# Altium project PCB-Tester-Board-V1.PrjPcb (part 3 of 3)

## Sheet PowerRouting.SchDoc
size A4; DateDraw: Date Draw; DateChecked: Date Review; Workspace: Workspace; TitleTyp: Title-Typ; PageSetup: Record=PageOptions|CenterHorizontal=True|CenterVertical=True|PrintScale=0.97|XCorrection=1.00|YCorrection=1.00|PrintKind=0|BorderSize=5000000|LeftOffset=0|BottomOffset=0|Orientation=2|PaperLength=1000|PaperWidth=1000|Scale=100|PaperSource=7|PrintQuality=-3|MediaType=1|DitherType=10|PrintScaleMode=1|PaperKind=A4|PaperIndex=9
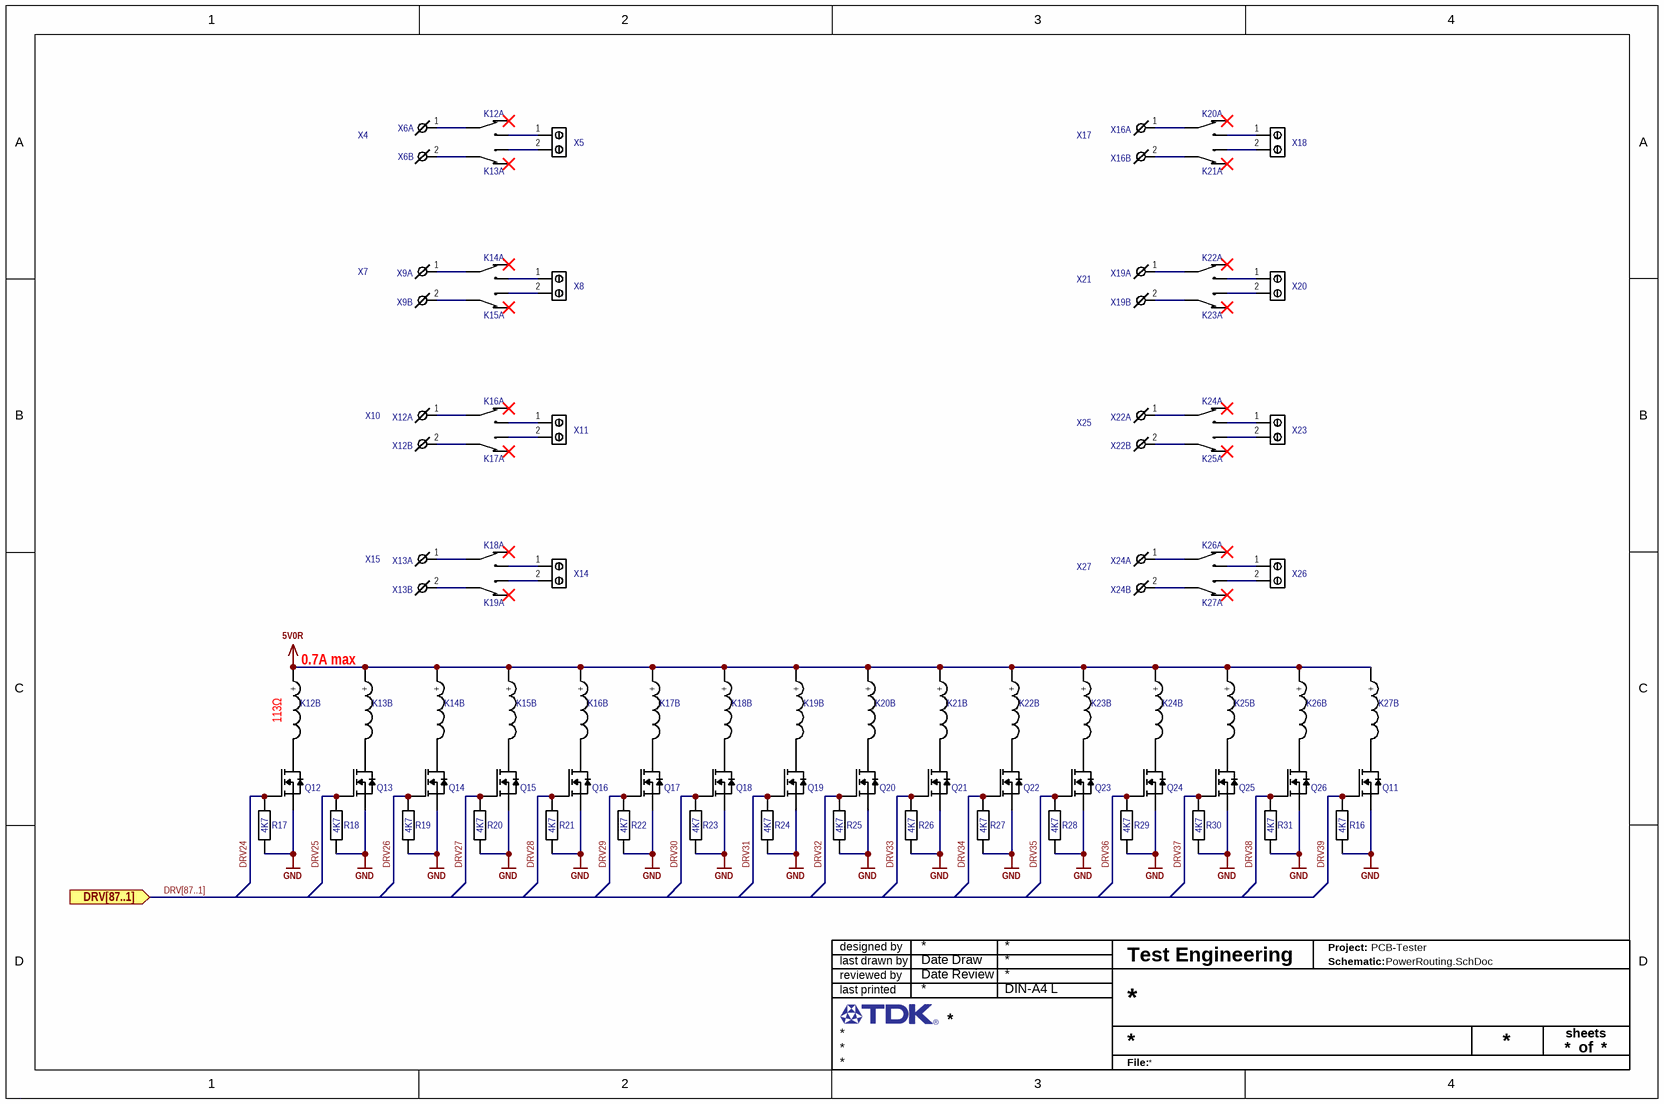
[diagram p11: PowerRouting.SchDoc]

### Parts
K12  K  [HF118F005-1ZS1]  (value not drawn)  (parts A,B of 2)
K13  K  [HF118F005-1ZS1]  (value not drawn)  (parts A,B of 2)
K14  K  [HF118F005-1ZS1]  (value not drawn)  (parts A,B of 2)
K15  K  [HF118F005-1ZS1]  (value not drawn)  (parts A,B of 2)
K16  K  [HF118F005-1ZS1]  (value not drawn)  (parts A,B of 2)
K17  K  [HF118F005-1ZS1]  (value not drawn)  (parts A,B of 2)
K18  K  [HF118F005-1ZS1]  (value not drawn)  (parts A,B of 2)
K19  K  [HF118F005-1ZS1]  (value not drawn)  (parts A,B of 2)
K20  K  [HF118F005-1ZS1]  (value not drawn)  (parts A,B of 2)
K21  K  [HF118F005-1ZS1]  (value not drawn)  (parts A,B of 2)
K22  K  [HF118F005-1ZS1]  (value not drawn)  (parts A,B of 2)
K23  K  [HF118F005-1ZS1]  (value not drawn)  (parts A,B of 2)
K24  K  [HF118F005-1ZS1]  (value not drawn)  (parts A,B of 2)
K25  K  [HF118F005-1ZS1]  (value not drawn)  (parts A,B of 2)
K26  K  [HF118F005-1ZS1]  (value not drawn)  (parts A,B of 2)
K27  K  [HF118F005-1ZS1]  (value not drawn)  (parts A,B of 2)
Q11  Q  [SOT23-3]  (value not drawn)
Q12  Q  [SOT23-3]  (value not drawn)
Q13  Q  [SOT23-3]  (value not drawn)
Q14  Q  [SOT23-3]  (value not drawn)
Q15  Q  [SOT23-3]  (value not drawn)
Q16  Q  [SOT23-3]  (value not drawn)
Q17  Q  [SOT23-3]  (value not drawn)
Q18  Q  [SOT23-3]  (value not drawn)
Q19  Q  [SOT23-3]  (value not drawn)
Q20  Q  [SOT23-3]  (value not drawn)
Q21  Q  [SOT23-3]  (value not drawn)
Q22  Q  [SOT23-3]  (value not drawn)
Q23  Q  [SOT23-3]  (value not drawn)
Q24  Q  [SOT23-3]  (value not drawn)
Q25  Q  [SOT23-3]  (value not drawn)
Q26  Q  [SOT23-3]  (value not drawn)
R16  value 4K7  [R0402 Reflow]  (hidden comment: R)
R17  value 4K7  [R0402 Reflow]  (hidden comment: R)
R18  value 4K7  [R0402 Reflow]  (hidden comment: R)
R19  value 4K7  [R0402 Reflow]  (hidden comment: R)
R20  value 4K7  [R0402 Reflow]  (hidden comment: R)
R21  value 4K7  [R0402 Reflow]  (hidden comment: R)
R22  value 4K7  [R0402 Reflow]  (hidden comment: R)
R23  value 4K7  [R0402 Reflow]  (hidden comment: R)
R24  value 4K7  [R0402 Reflow]  (hidden comment: R)
R25  value 4K7  [R0402 Reflow]  (hidden comment: R)
R26  value 4K7  [R0402 Reflow]  (hidden comment: R)
R27  value 4K7  [R0402 Reflow]  (hidden comment: R)
R28  value 4K7  [R0402 Reflow]  (hidden comment: R)
R29  value 4K7  [R0402 Reflow]  (hidden comment: R)
R30  value 4K7  [R0402 Reflow]  (hidden comment: R)
R31  value 4K7  [R0402 Reflow]  (hidden comment: R)
X4  X  [691352710002]  (value not drawn)
X5  X  [1731721]  (value not drawn)
X6  X  [691312710002]  (value not drawn)  (parts A,B of 2)
X7  X  [691352710002]  (value not drawn)
X8  X  [1731721]  (value not drawn)
X9  X  [691312710002]  (value not drawn)  (parts A,B of 2)
X10  X  [691352710002]  (value not drawn)
X11  X  [1731721]  (value not drawn)
X12  X  [691312710002]  (value not drawn)  (parts A,B of 2)
X13  X  [691312710002]  (value not drawn)  (parts A,B of 2)
X14  X  [1731721]  (value not drawn)
X15  X  [691352710002]  (value not drawn)
X16  X  [691312710002]  (value not drawn)  (parts A,B of 2)
X17  X  [691352710002]  (value not drawn)
X18  X  [1731721]  (value not drawn)
X19  X  [691312710002]  (value not drawn)  (parts A,B of 2)
X20  X  [1731721]  (value not drawn)
X21  X  [691352710002]  (value not drawn)
X22  X  [691312710002]  (value not drawn)  (parts A,B of 2)
X23  X  [1731721]  (value not drawn)
X24  X  [691312710002]  (value not drawn)  (parts A,B of 2)
X25  X  [691352710002]  (value not drawn)
X26  X  [1731721]  (value not drawn)
X27  X  [691352710002]  (value not drawn)

### Ports
DRV[87..1] (in)

### Nets
5V0R: K12.1(+) K13.1(+) K14.1(+) K15.1(+) K16.1(+) K17.1(+) K18.1(+) K19.1(+) K20.1(+) K21.1(+) K22.1(+) K23.1(+) K24.1(+) K25.1(+) K26.1(+) K27.1(+)
GND: Q11.2(S) Q12.2(S) Q13.2(S) Q14.2(S) Q15.2(S) Q16.2(S) Q17.2(S) Q18.2(S) Q19.2(S) Q20.2(S) Q21.2(S) Q22.2(S) Q23.2(S) Q24.2(S) Q25.2(S) Q26.2(S) R16.1 R17.1 R18.1 R19.1 R20.1 R21.1 R22.1 R23.1 R24.1 R25.1 R26.1 R27.1 R28.1 R29.1 R30.1 R31.1
DRV24: Q12.1(G) R17.2
DRV25: Q13.1(G) R18.2
DRV26: Q14.1(G) R19.2
DRV27: Q15.1(G) R20.2
DRV28: Q16.1(G) R21.2
DRV29: Q17.1(G) R22.2
DRV30: Q18.1(G) R23.2
DRV31: Q19.1(G) R24.2
DRV32: Q20.1(G) R25.2
DRV33: Q21.1(G) R26.2
DRV34: Q22.1(G) R27.2
DRV35: Q23.1(G) R28.2
DRV36: Q24.1(G) R29.2
DRV37: Q25.1(G) R30.2
DRV38: Q26.1(G) R31.2
DRV39: Q11.1(G) R16.2
NetK12_2: K12.2(Cin) X6.1(+)
NetK12_3: K12.3(Cno) X5.1
NetK12_5: K12.5(-) Q12.3(D)
NetK13_2: K13.2(Cin) X6.2(-)
NetK13_3: K13.3(Cno) X5.2
NetK13_5: K13.5(-) Q13.3(D)
NetK14_2: K14.2(Cin) X9.1(+)
NetK14_3: K14.3(Cno) X8.1
NetK14_5: K14.5(-) Q14.3(D)
NetK15_2: K15.2(Cin) X9.2(-)
NetK15_3: K15.3(Cno) X8.2
NetK15_5: K15.5(-) Q15.3(D)
NetK16_2: K16.2(Cin) X12.1(+)
NetK16_3: K16.3(Cno) X11.1
NetK16_5: K16.5(-) Q16.3(D)
NetK17_2: K17.2(Cin) X12.2(-)
NetK17_3: K17.3(Cno) X11.2
NetK17_5: K17.5(-) Q17.3(D)
NetK18_2: K18.2(Cin) X13.1(+)
NetK18_3: K18.3(Cno) X14.1
NetK18_5: K18.5(-) Q18.3(D)
NetK19_2: K19.2(Cin) X13.2(-)
NetK19_3: K19.3(Cno) X14.2
NetK19_5: K19.5(-) Q19.3(D)
NetK20_2: K20.2(Cin) X16.1(+)
NetK20_3: K20.3(Cno) X18.1
NetK20_5: K20.5(-) Q20.3(D)
NetK21_2: K21.2(Cin) X16.2(-)
NetK21_3: K21.3(Cno) X18.2
NetK21_5: K21.5(-) Q21.3(D)
NetK22_2: K22.2(Cin) X19.1(+)
NetK22_3: K22.3(Cno) X20.1
NetK22_5: K22.5(-) Q22.3(D)
NetK23_2: K23.2(Cin) X19.2(-)
NetK23_3: K23.3(Cno) X20.2
NetK23_5: K23.5(-) Q23.3(D)
NetK24_2: K24.2(Cin) X22.1(+)
NetK24_3: K24.3(Cno) X23.1
NetK24_5: K24.5(-) Q24.3(D)
NetK25_2: K25.2(Cin) X22.2(-)
NetK25_3: K25.3(Cno) X23.2
NetK25_5: K25.5(-) Q25.3(D)
NetK26_2: K26.2(Cin) X24.1(+)
NetK26_3: K26.3(Cno) X26.1
NetK26_5: K26.5(-) Q26.3(D)
NetK27_2: K27.2(Cin) X24.2(-)
NetK27_3: K27.3(Cno) X26.2
NetK27_5: K27.5(-) Q11.3(D)

Not connected (* = marked no-connect by the designer): K12 4(Cnc)*; K13 4(Cnc)*; K14 4(Cnc)*; K15 4(Cnc)*; K16 4(Cnc)*; K17 4(Cnc)*; K18 4(Cnc)*; K19 4(Cnc)*; K20 4(Cnc)*; K21 4(Cnc)*; K22 4(Cnc)*; K23 4(Cnc)*; K24 4(Cnc)*; K25 4(Cnc)*; K26 4(Cnc)*; K27 4(Cnc)*

### Buses and harness runs
bus DRV[87..1] = port DRV[87..1]

### Notes on the sheet
- 0.7A max
- designed by
- reviewed by
- last drawn by
- Project:
- Schematic:
- last printed
- DIN-A4 L
- sheets
- of
- File:

### Library data of the parts
K12-K27 = HF118F005-1ZS1: 5V Power Relay, switch over; 04. Manufacturer: Hongfa Europe GMBH; 07. Manufacturer  Part Number: HF118F/005-1ZS1T(136); 03. Unit Price: 2.60; 13. Created Date/Name: AUG2018/Hören; Coil Resistance: 113Ω; Max Carry Current: 10A; Max Switch Voltage: 440Vac/125Vdc; Power Rating: 300Wdc/2.5KVAac; 01. Distributor: RS-Components; 02. Distributor Part Number: 176-2821; 09. Operating Temperature: -xx..+yy°C; 11. RoHS: YES; ComponentLink1Description: Info; ComponentLink1URL: https://de.rs-online.com/web/p/monostabile-relais/1762821/; ComponentLink2Description: DataSheet; ComponentLink2URL: https://docs.rs-online.com/c37d/0900766b81663e9a.pdf; Coil Voltage: 5V; Max Switch Current: 10A
Q11-Q26 = FDV303N: MOSFET N-CH 25V 680MA SOT-23; 04. Manufacturer: ON Semiconductor; 03. Unit Price: 0.41; 13. Created Date/Name: AUG 2018 / Hören; Rds On: 450 mΩ @ id=500mA & Vgs=4.5V; Vgs,th: 1.5V @ 250uA; Power Rating: 350mW; 3D-Export: No; 01. Distributor: DigiKey; 02. Distributor Part Number: FDV303NDKR-ND; 07. Manufacturer  Part Number: FDV303N; 09. Operating Temperature: -55°C ~ 150°C (TJ); 11. RoHS: YES; ComponentLink1Description: Info; ComponentLink1URL: https://www.digikey.de/product-detail/en/on-semiconductor/FDV303N/FDV303NDKR-ND/1630434; ComponentLink2Description: DataSheet; ComponentLink2URL: https://media.digikey.com/pdf/Data%20Sheets/Fairchild%20PDFs/FDV303N.pdf; Vdss: 25V; Id: 680mA
R16-R31 = R: Resistor; Tolerance: ±1%; 13. Created Date/Name: AUG2018/Hören; ComponentLink1URL: *; ComponentLink1Description: Info; 09. Operating Temperature: -xx..+yy°C; 11. RoHS: ???; ComponentLink2Description: DataSheet; Package: *
X4 X7 X10 X15 X17 X21 X25 X27 = 691352710002: TERM BLOCK PLUG 2POS STR 5MM; 13. Created Date/Name: ??? / Hören; System: Connector; ComponentLink1Description: Info; ComponentLink1URL: https://www.digikey.de/products/en?keywords=691352710002; ComponentLink2Description: DataSheet; ComponentLink2URL: https://www.we-online.de/katalog/datasheet/6913527100xx.pdf
X5 X8 X11 X14 X18 X20 X23 X26 = 1731721: TERM BLK 2P SIDE ENT 7.62MM PCB; 04. Manufacturer: Phoenix Contact; 03. Unit Price: 2.12; 13. Created Date/Name: JAN 2019 / Hören; System: Connector; 01. Distributor: DigiKey; 02. Distributor Part Number: 277-5849-ND; 07. Manufacturer  Part Number: 1731721; 11. RoHS: YES; ComponentLink1Description: Info; ComponentLink1URL: https://www.digikey.de/products/en?keywords=1731721; ComponentLink2Description: DataSheet; ComponentLink2URL: https://media.digikey.com/pdf/Data%20Sheets/Phoenix%20Contact%20PDFs/1731721.pdf
X6 X9 X12 X13 X16 X19 X22 X24 = 691312710002: TERM BLOCK HDR 2POS 90DEG 5MM; 04. Manufacturer: Würth Elektronik; 03. Unit Price: 0.244; 13. Created Date/Name: ??? / Hören; System: Connector; 01. Distributor: DigiKey; 02. Distributor Part Number: 732-2805-ND; 07. Manufacturer  Part Number: 691312710002; ComponentLink1Description: Info; ComponentLink2Description: DataSheet

## Sheet SignalRouting.SchDoc
size A3 portrait; DateDraw: Date Draw; DateChecked: Date Review; Workspace: Workspace; TitleTyp: Title-Typ; PageSetup: Record=PageOptions|CenterHorizontal=True|CenterVertical=True|PrintScale=0.97|XCorrection=1.00|YCorrection=1.00|PrintKind=0|BorderSize=5000000|LeftOffset=0|BottomOffset=0|Orientation=2|PaperLength=1000|PaperWidth=1000|Scale=100|PaperSource=7|PrintQuality=-3|MediaType=1|DitherType=10|PrintScaleMode=1|PaperKind=A4|PaperIndex=9
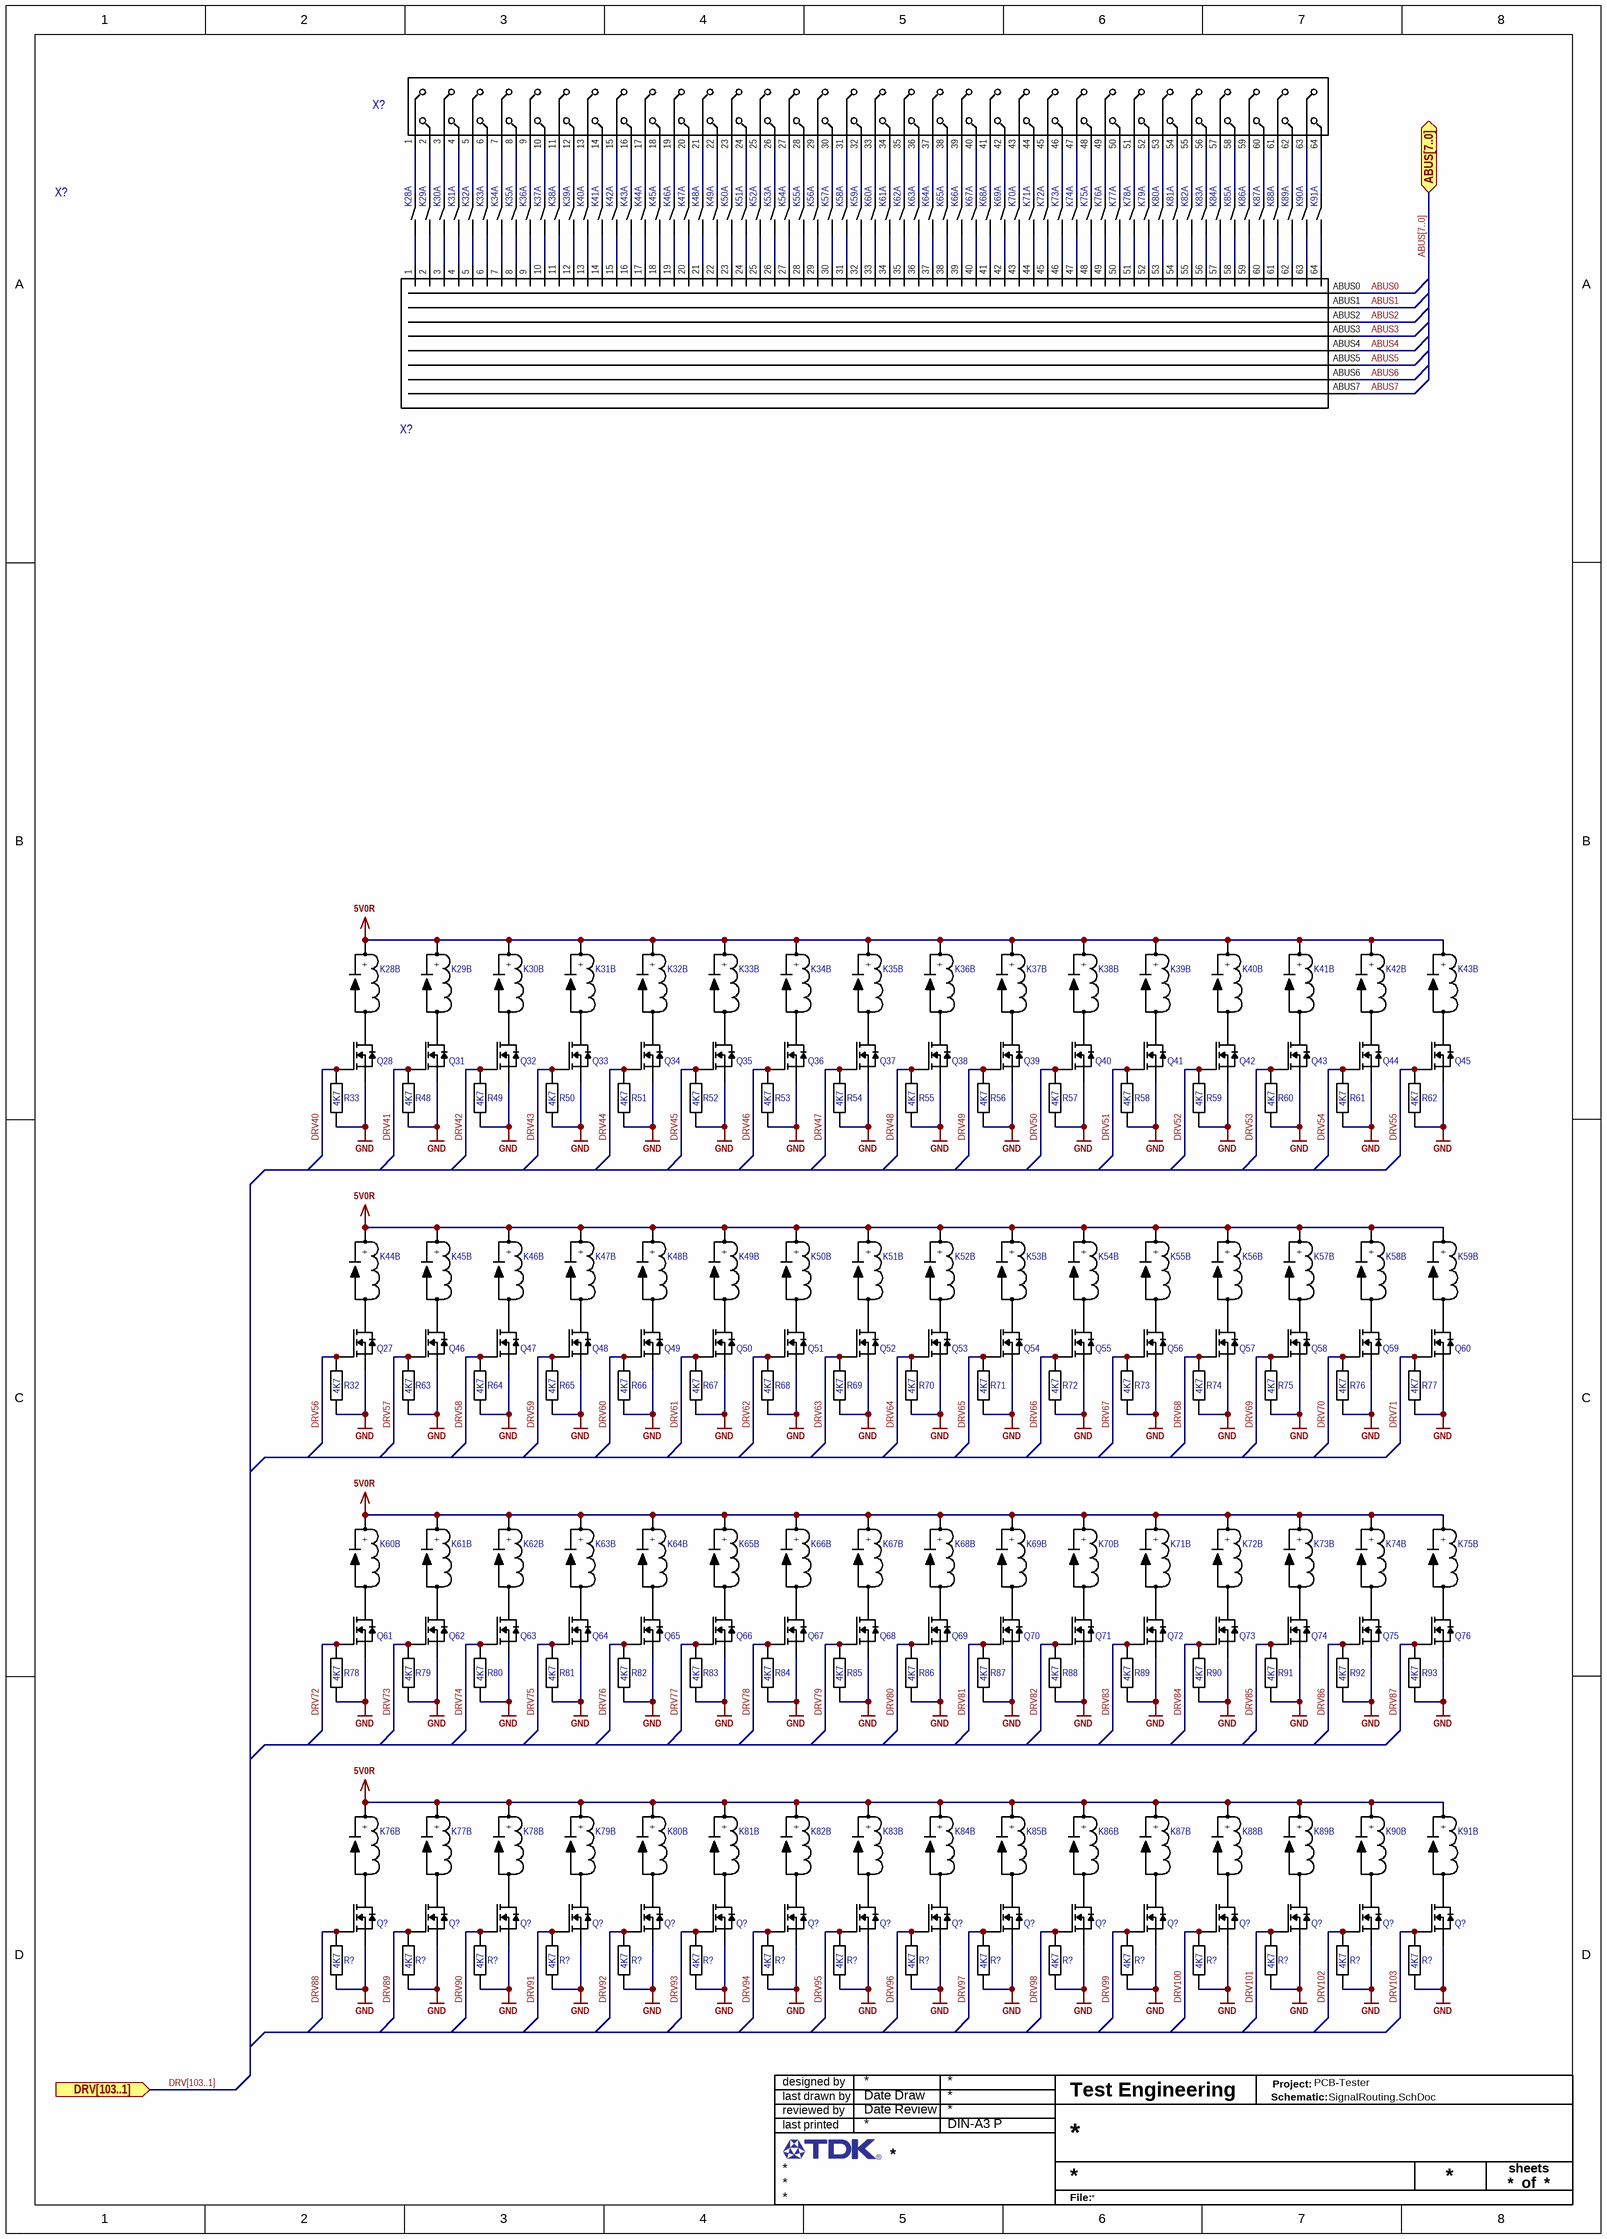
[diagram p12: SignalRouting.SchDoc]

### Parts
(Parts that share a designator on the sheet are numbered #1, #2 ... from top to bottom, then left to right.)
K28  K  [118-1A]  (value not drawn)  (parts A,B of 2)
K29  K  [118-1A]  (value not drawn)  (parts A,B of 2)
K30  K  [118-1A]  (value not drawn)  (parts A,B of 2)
K31  K  [118-1A]  (value not drawn)  (parts A,B of 2)
K32  K  [118-1A]  (value not drawn)  (parts A,B of 2)
K33  K  [118-1A]  (value not drawn)  (parts A,B of 2)
K34  K  [118-1A]  (value not drawn)  (parts A,B of 2)
K35  K  [118-1A]  (value not drawn)  (parts A,B of 2)
K36  K  [118-1A]  (value not drawn)  (parts A,B of 2)
K37  K  [118-1A]  (value not drawn)  (parts A,B of 2)
K38  K  [118-1A]  (value not drawn)  (parts A,B of 2)
K39  K  [118-1A]  (value not drawn)  (parts A,B of 2)
K40  K  [118-1A]  (value not drawn)  (parts A,B of 2)
K41  K  [118-1A]  (value not drawn)  (parts A,B of 2)
K42  K  [118-1A]  (value not drawn)  (parts A,B of 2)
K43  K  [118-1A]  (value not drawn)  (parts A,B of 2)
K44  K  [118-1A]  (value not drawn)  (parts A,B of 2)
K45  K  [118-1A]  (value not drawn)  (parts A,B of 2)
K46  K  [118-1A]  (value not drawn)  (parts A,B of 2)
K47  K  [118-1A]  (value not drawn)  (parts A,B of 2)
K48  K  [118-1A]  (value not drawn)  (parts A,B of 2)
K49  K  [118-1A]  (value not drawn)  (parts A,B of 2)
K50  K  [118-1A]  (value not drawn)  (parts A,B of 2)
K51  K  [118-1A]  (value not drawn)  (parts A,B of 2)
K52  K  [118-1A]  (value not drawn)  (parts A,B of 2)
K53  K  [118-1A]  (value not drawn)  (parts A,B of 2)
K54  K  [118-1A]  (value not drawn)  (parts A,B of 2)
K55  K  [118-1A]  (value not drawn)  (parts A,B of 2)
K56  K  [118-1A]  (value not drawn)  (parts A,B of 2)
K57  K  [118-1A]  (value not drawn)  (parts A,B of 2)
K58  K  [118-1A]  (value not drawn)  (parts A,B of 2)
K59  K  [118-1A]  (value not drawn)  (parts A,B of 2)
K60  K  [118-1A]  (value not drawn)  (parts A,B of 2)
K61  K  [118-1A]  (value not drawn)  (parts A,B of 2)
K62  K  [118-1A]  (value not drawn)  (parts A,B of 2)
K63  K  [118-1A]  (value not drawn)  (parts A,B of 2)
K64  K  [118-1A]  (value not drawn)  (parts A,B of 2)
K65  K  [118-1A]  (value not drawn)  (parts A,B of 2)
K66  K  [118-1A]  (value not drawn)  (parts A,B of 2)
K67  K  [118-1A]  (value not drawn)  (parts A,B of 2)
K68  K  [118-1A]  (value not drawn)  (parts A,B of 2)
K69  K  [118-1A]  (value not drawn)  (parts A,B of 2)
K70  K  [118-1A]  (value not drawn)  (parts A,B of 2)
K71  K  [118-1A]  (value not drawn)  (parts A,B of 2)
K72  K  [118-1A]  (value not drawn)  (parts A,B of 2)
K73  K  [118-1A]  (value not drawn)  (parts A,B of 2)
K74  K  [118-1A]  (value not drawn)  (parts A,B of 2)
K75  K  [118-1A]  (value not drawn)  (parts A,B of 2)
K76  K  [118-1A]  (value not drawn)  (parts A,B of 2)
K77  K  [118-1A]  (value not drawn)  (parts A,B of 2)
K78  K  [118-1A]  (value not drawn)  (parts A,B of 2)
K79  K  [118-1A]  (value not drawn)  (parts A,B of 2)
K80  K  [118-1A]  (value not drawn)  (parts A,B of 2)
K81  K  [118-1A]  (value not drawn)  (parts A,B of 2)
K82  K  [118-1A]  (value not drawn)  (parts A,B of 2)
K83  K  [118-1A]  (value not drawn)  (parts A,B of 2)
K84  K  [118-1A]  (value not drawn)  (parts A,B of 2)
K85  K  [118-1A]  (value not drawn)  (parts A,B of 2)
K86  K  [118-1A]  (value not drawn)  (parts A,B of 2)
K87  K  [118-1A]  (value not drawn)  (parts A,B of 2)
K88  K  [118-1A]  (value not drawn)  (parts A,B of 2)
K89  K  [118-1A]  (value not drawn)  (parts A,B of 2)
K90  K  [118-1A]  (value not drawn)  (parts A,B of 2)
K91  K  [118-1A]  (value not drawn)  (parts A,B of 2)
Q27  Q  [SOT23-3]  (value not drawn)
Q28  Q  [SOT23-3]  (value not drawn)
Q31  Q  [SOT23-3]  (value not drawn)
Q32  Q  [SOT23-3]  (value not drawn)
Q33  Q  [SOT23-3]  (value not drawn)
Q34  Q  [SOT23-3]  (value not drawn)
Q35  Q  [SOT23-3]  (value not drawn)
Q36  Q  [SOT23-3]  (value not drawn)
Q37  Q  [SOT23-3]  (value not drawn)
Q38  Q  [SOT23-3]  (value not drawn)
Q39  Q  [SOT23-3]  (value not drawn)
Q40  Q  [SOT23-3]  (value not drawn)
Q41  Q  [SOT23-3]  (value not drawn)
Q42  Q  [SOT23-3]  (value not drawn)
Q43  Q  [SOT23-3]  (value not drawn)
Q44  Q  [SOT23-3]  (value not drawn)
Q45  Q  [SOT23-3]  (value not drawn)
Q46  Q  [SOT23-3]  (value not drawn)
Q47  Q  [SOT23-3]  (value not drawn)
Q48  Q  [SOT23-3]  (value not drawn)
Q49  Q  [SOT23-3]  (value not drawn)
Q50  Q  [SOT23-3]  (value not drawn)
Q51  Q  [SOT23-3]  (value not drawn)
Q52  Q  [SOT23-3]  (value not drawn)
Q53  Q  [SOT23-3]  (value not drawn)
Q54  Q  [SOT23-3]  (value not drawn)
Q55  Q  [SOT23-3]  (value not drawn)
Q56  Q  [SOT23-3]  (value not drawn)
Q57  Q  [SOT23-3]  (value not drawn)
Q58  Q  [SOT23-3]  (value not drawn)
Q59  Q  [SOT23-3]  (value not drawn)
Q60  Q  [SOT23-3]  (value not drawn)
Q61  Q  [SOT23-3]  (value not drawn)
Q62  Q  [SOT23-3]  (value not drawn)
Q63  Q  [SOT23-3]  (value not drawn)
Q64  Q  [SOT23-3]  (value not drawn)
Q65  Q  [SOT23-3]  (value not drawn)
Q66  Q  [SOT23-3]  (value not drawn)
Q67  Q  [SOT23-3]  (value not drawn)
Q68  Q  [SOT23-3]  (value not drawn)
Q69  Q  [SOT23-3]  (value not drawn)
Q70  Q  [SOT23-3]  (value not drawn)
Q71  Q  [SOT23-3]  (value not drawn)
Q72  Q  [SOT23-3]  (value not drawn)
Q73  Q  [SOT23-3]  (value not drawn)
Q74  Q  [SOT23-3]  (value not drawn)
Q75  Q  [SOT23-3]  (value not drawn)
Q76  Q  [SOT23-3]  (value not drawn)
Q?#1  Q  [SOT23-3]  (value not drawn)
Q?#2  Q  [SOT23-3]  (value not drawn)
Q?#3  Q  [SOT23-3]  (value not drawn)
Q?#4  Q  [SOT23-3]  (value not drawn)
Q?#5  Q  [SOT23-3]  (value not drawn)
Q?#6  Q  [SOT23-3]  (value not drawn)
Q?#7  Q  [SOT23-3]  (value not drawn)
Q?#8  Q  [SOT23-3]  (value not drawn)
Q?#9  Q  [SOT23-3]  (value not drawn)
Q?#10  Q  [SOT23-3]  (value not drawn)
Q?#11  Q  [SOT23-3]  (value not drawn)
Q?#12  Q  [SOT23-3]  (value not drawn)
Q?#13  Q  [SOT23-3]  (value not drawn)
Q?#14  Q  [SOT23-3]  (value not drawn)
Q?#15  Q  [SOT23-3]  (value not drawn)
Q?#16  Q  [SOT23-3]  (value not drawn)
R32  value 4K7  [R0402 Reflow]  (hidden comment: R)
R33  value 4K7  [R0402 Reflow]  (hidden comment: R)
R48  value 4K7  [R0402 Reflow]  (hidden comment: R)
R49  value 4K7  [R0402 Reflow]  (hidden comment: R)
R50  value 4K7  [R0402 Reflow]  (hidden comment: R)
R51  value 4K7  [R0402 Reflow]  (hidden comment: R)
R52  value 4K7  [R0402 Reflow]  (hidden comment: R)
R53  value 4K7  [R0402 Reflow]  (hidden comment: R)
R54  value 4K7  [R0402 Reflow]  (hidden comment: R)
R55  value 4K7  [R0402 Reflow]  (hidden comment: R)
R56  value 4K7  [R0402 Reflow]  (hidden comment: R)
R57  value 4K7  [R0402 Reflow]  (hidden comment: R)
R58  value 4K7  [R0402 Reflow]  (hidden comment: R)
R59  value 4K7  [R0402 Reflow]  (hidden comment: R)
R60  value 4K7  [R0402 Reflow]  (hidden comment: R)
R61  value 4K7  [R0402 Reflow]  (hidden comment: R)
R62  value 4K7  [R0402 Reflow]  (hidden comment: R)
R63  value 4K7  [R0402 Reflow]  (hidden comment: R)
R64  value 4K7  [R0402 Reflow]  (hidden comment: R)
R65  value 4K7  [R0402 Reflow]  (hidden comment: R)
R66  value 4K7  [R0402 Reflow]  (hidden comment: R)
R67  value 4K7  [R0402 Reflow]  (hidden comment: R)
R68  value 4K7  [R0402 Reflow]  (hidden comment: R)
R69  value 4K7  [R0402 Reflow]  (hidden comment: R)
R70  value 4K7  [R0402 Reflow]  (hidden comment: R)
R71  value 4K7  [R0402 Reflow]  (hidden comment: R)
R72  value 4K7  [R0402 Reflow]  (hidden comment: R)
R73  value 4K7  [R0402 Reflow]  (hidden comment: R)
R74  value 4K7  [R0402 Reflow]  (hidden comment: R)
R75  value 4K7  [R0402 Reflow]  (hidden comment: R)
R76  value 4K7  [R0402 Reflow]  (hidden comment: R)
R77  value 4K7  [R0402 Reflow]  (hidden comment: R)
R78  value 4K7  [R0402 Reflow]  (hidden comment: R)
R79  value 4K7  [R0402 Reflow]  (hidden comment: R)
R80  value 4K7  [R0402 Reflow]  (hidden comment: R)
R81  value 4K7  [R0402 Reflow]  (hidden comment: R)
R82  value 4K7  [R0402 Reflow]  (hidden comment: R)
R83  value 4K7  [R0402 Reflow]  (hidden comment: R)
R84  value 4K7  [R0402 Reflow]  (hidden comment: R)
R85  value 4K7  [R0402 Reflow]  (hidden comment: R)
R86  value 4K7  [R0402 Reflow]  (hidden comment: R)
R87  value 4K7  [R0402 Reflow]  (hidden comment: R)
R88  value 4K7  [R0402 Reflow]  (hidden comment: R)
R89  value 4K7  [R0402 Reflow]  (hidden comment: R)
R90  value 4K7  [R0402 Reflow]  (hidden comment: R)
R91  value 4K7  [R0402 Reflow]  (hidden comment: R)
R92  value 4K7  [R0402 Reflow]  (hidden comment: R)
R93  value 4K7  [R0402 Reflow]  (hidden comment: R)
R?#1  value 4K7  [R0402 Reflow]  (hidden comment: R)
R?#2  value 4K7  [R0402 Reflow]  (hidden comment: R)
R?#3  value 4K7  [R0402 Reflow]  (hidden comment: R)
R?#4  value 4K7  [R0402 Reflow]  (hidden comment: R)
R?#5  value 4K7  [R0402 Reflow]  (hidden comment: R)
R?#6  value 4K7  [R0402 Reflow]  (hidden comment: R)
R?#7  value 4K7  [R0402 Reflow]  (hidden comment: R)
R?#8  value 4K7  [R0402 Reflow]  (hidden comment: R)
R?#9  value 4K7  [R0402 Reflow]  (hidden comment: R)
R?#10  value 4K7  [R0402 Reflow]  (hidden comment: R)
R?#11  value 4K7  [R0402 Reflow]  (hidden comment: R)
R?#12  value 4K7  [R0402 Reflow]  (hidden comment: R)
R?#13  value 4K7  [R0402 Reflow]  (hidden comment: R)
R?#14  value 4K7  [R0402 Reflow]  (hidden comment: R)
R?#15  value 4K7  [R0402 Reflow]  (hidden comment: R)
R?#16  value 4K7  [R0402 Reflow]  (hidden comment: R)
X?#1  X  [TFC-132-01-F-D-LA]  (value not drawn)
X?#2  X  (value not drawn)  (mechanical)
X?#3  X  [CONFIG64]  (value not drawn)  (no BOM)

### Ports
ABUS[7..0] (bidir), DRV[103..1] (in)

### Nets
5V0R: K28.1(+) K29.1(+) K30.1(+) K31.1(+) K32.1(+) K33.1(+) K34.1(+) K35.1(+) K36.1(+) K37.1(+) K38.1(+) K39.1(+) K40.1(+) K41.1(+) K42.1(+) K43.1(+) K44.1(+) K45.1(+) K46.1(+) K47.1(+) K48.1(+) K49.1(+) K50.1(+) K51.1(+) K52.1(+) K53.1(+) K54.1(+) K55.1(+) K56.1(+) K57.1(+) K58.1(+) K59.1(+) K60.1(+) K61.1(+) K62.1(+) K63.1(+) K64.1(+) K65.1(+) K66.1(+) K67.1(+) K68.1(+) K69.1(+) K70.1(+) K71.1(+) K72.1(+) K73.1(+) K74.1(+) K75.1(+) K76.1(+) K77.1(+) K78.1(+) K79.1(+) K80.1(+) K81.1(+) K82.1(+) K83.1(+) K84.1(+) K85.1(+) K86.1(+) K87.1(+) K88.1(+) K89.1(+) K90.1(+) K91.1(+)
GND: Q27.2(S) Q28.2(S) Q31.2(S) Q32.2(S) Q33.2(S) Q34.2(S) Q35.2(S) Q36.2(S) Q37.2(S) Q38.2(S) Q39.2(S) Q40.2(S) Q41.2(S) Q42.2(S) Q43.2(S) Q44.2(S) Q45.2(S) Q46.2(S) Q47.2(S) Q48.2(S) Q49.2(S) Q50.2(S) Q51.2(S) Q52.2(S) Q53.2(S) Q54.2(S) Q55.2(S) Q56.2(S) Q57.2(S) Q58.2(S) Q59.2(S) Q60.2(S) Q61.2(S) Q62.2(S) Q63.2(S) Q64.2(S) Q65.2(S) Q66.2(S) Q67.2(S) Q68.2(S) Q69.2(S) Q70.2(S) Q71.2(S) Q72.2(S) Q73.2(S) Q74.2(S) Q75.2(S) Q76.2(S) Q?#1.2(S) Q?#2.2(S) Q?#3.2(S) Q?#4.2(S) Q?#5.2(S) Q?#6.2(S) Q?#7.2(S) Q?#8.2(S) Q?#9.2(S) Q?#10.2(S) Q?#11.2(S) Q?#12.2(S) Q?#13.2(S) Q?#14.2(S) Q?#15.2(S) Q?#16.2(S) R32.1 R33.1 R48.1 R49.1 R50.1 R51.1 R52.1 R53.1 R54.1 R55.1 R56.1 R57.1 R58.1 R59.1 R60.1 R61.1 R62.1 R63.1 R64.1 R65.1 R66.1 R67.1 R68.1 R69.1 R70.1 R71.1 R72.1 R73.1 R74.1 R75.1 R76.1 R77.1 R78.1 R79.1 R80.1 R81.1 R82.1 R83.1 R84.1 R85.1 R86.1 R87.1 R88.1 R89.1 R90.1 R91.1 R92.1 R93.1 R?#1.1 R?#2.1 R?#3.1 R?#4.1 R?#5.1 R?#6.1 R?#7.1 R?#8.1 R?#9.1 R?#10.1 R?#11.1 R?#12.1 R?#13.1 R?#14.1 R?#15.1 R?#16.1
ABUS0: X?#3.ABUS0
ABUS1: X?#3.ABUS1
ABUS2: X?#3.ABUS2
ABUS3: X?#3.ABUS3
ABUS4: X?#3.ABUS4
ABUS5: X?#3.ABUS5
ABUS6: X?#3.ABUS6
ABUS7: X?#3.ABUS7
DRV40: Q27.1(G) Q28.1(G) Q61.1(G) Q?#1.1(G) R32.2 R33.2 R78.2 R?#1.2  [also labelled DRV56, DRV72, DRV88]  [project net DRV24]
DRV41: Q31.1(G) Q46.1(G) Q62.1(G) Q?#2.1(G) R48.2 R63.2 R79.2 R?#2.2  [also labelled DRV57, DRV73, DRV89]  [project net DRV25]
DRV42: Q32.1(G) Q47.1(G) Q63.1(G) Q?#3.1(G) R49.2 R64.2 R80.2 R?#3.2  [also labelled DRV58, DRV74, DRV90]  [project net DRV10]
DRV43: Q33.1(G) Q48.1(G) Q64.1(G) Q?#4.1(G) R50.2 R65.2 R81.2 R?#4.2  [also labelled DRV59, DRV75, DRV91]  [project net DRV11]
DRV44: Q34.1(G) Q49.1(G) Q65.1(G) Q?#5.1(G) R51.2 R66.2 R82.2 R?#5.2  [also labelled DRV60, DRV76, DRV92]  [project net DRV12]
DRV45: Q35.1(G) Q50.1(G) Q66.1(G) Q?#6.1(G) R52.2 R67.2 R83.2 R?#6.2  [also labelled DRV61, DRV77, DRV93]  [project net DRV13]
DRV46: Q36.1(G) Q51.1(G) Q67.1(G) Q?#7.1(G) R53.2 R68.2 R84.2 R?#7.2  [also labelled DRV62, DRV78, DRV94]  [project net DRV14]
DRV47: Q37.1(G) Q52.1(G) Q68.1(G) Q?#8.1(G) R54.2 R69.2 R85.2 R?#8.2  [also labelled DRV63, DRV79, DRV95]  [project net DRV15]
DRV48: Q38.1(G) Q53.1(G) Q69.1(G) Q?#9.1(G) R55.2 R70.2 R86.2 R?#9.2  [also labelled DRV64, DRV80, DRV96]  [project net DRV16]
DRV49: Q39.1(G) Q54.1(G) Q70.1(G) Q?#10.1(G) R56.2 R71.2 R87.2 R?#10.2  [also labelled DRV65, DRV81, DRV97]  [project net DRV1]
DRV50: Q40.1(G) Q55.1(G) Q71.1(G) Q?#11.1(G) R57.2 R72.2 R88.2 R?#11.2  [also labelled DRV66, DRV82, DRV98]  [project net DRV18]
DRV51: Q41.1(G) Q56.1(G) Q72.1(G) Q?#12.1(G) R58.2 R73.2 R89.2 R?#12.2  [also labelled DRV67, DRV83, DRV99]  [project net DRV19]
DRV100: Q42.1(G) Q57.1(G) Q73.1(G) Q?#13.1(G) R59.2 R74.2 R90.2 R?#13.2  [also labelled DRV52, DRV68, DRV84]
DRV101: Q43.1(G) Q58.1(G) Q74.1(G) Q?#14.1(G) R60.2 R75.2 R91.2 R?#14.2  [also labelled DRV53, DRV69, DRV85]
DRV102: Q44.1(G) Q59.1(G) Q75.1(G) Q?#15.1(G) R61.2 R76.2 R92.2 R?#15.2  [also labelled DRV54, DRV70, DRV86]
DRV103: Q45.1(G) Q60.1(G) Q76.1(G) Q?#16.1(G) R62.2 R77.2 R93.2 R?#16.2  [also labelled DRV55, DRV71, DRV87]
NetK28_2: K28.2(-) Q28.3(D)
NetK28_3: K28.3(CA) X?#3.1
NetK28_4: K28.4(CB) X?#1.1
NetK29_2: K29.2(-) Q31.3(D)
NetK29_3: K29.3(CA) X?#3.2
NetK29_4: K29.4(CB) X?#1.2
NetK30_2: K30.2(-) Q32.3(D)
NetK30_3: K30.3(CA) X?#3.3
NetK30_4: K30.4(CB) X?#1.3
NetK31_2: K31.2(-) Q33.3(D)
NetK31_3: K31.3(CA) X?#3.4
NetK31_4: K31.4(CB) X?#1.4
NetK32_2: K32.2(-) Q34.3(D)
NetK32_3: K32.3(CA) X?#3.5
NetK32_4: K32.4(CB) X?#1.5
NetK33_2: K33.2(-) Q35.3(D)
NetK33_3: K33.3(CA) X?#3.6
NetK33_4: K33.4(CB) X?#1.6
NetK34_2: K34.2(-) Q36.3(D)
NetK34_3: K34.3(CA) X?#3.7
NetK34_4: K34.4(CB) X?#1.7
NetK35_2: K35.2(-) Q37.3(D)
NetK35_3: K35.3(CA) X?#3.8
NetK35_4: K35.4(CB) X?#1.8
NetK36_2: K36.2(-) Q38.3(D)
NetK36_3: K36.3(CA) X?#3.9
NetK36_4: K36.4(CB) X?#1.9
NetK37_2: K37.2(-) Q39.3(D)
NetK37_3: K37.3(CA) X?#3.10
NetK37_4: K37.4(CB) X?#1.10
NetK38_2: K38.2(-) Q40.3(D)
NetK38_3: K38.3(CA) X?#3.11
NetK38_4: K38.4(CB) X?#1.11
NetK39_2: K39.2(-) Q41.3(D)
NetK39_3: K39.3(CA) X?#3.12
NetK39_4: K39.4(CB) X?#1.12
NetK40_2: K40.2(-) Q42.3(D)
NetK40_3: K40.3(CA) X?#3.13
NetK40_4: K40.4(CB) X?#1.13
NetK41_2: K41.2(-) Q43.3(D)
NetK41_3: K41.3(CA) X?#3.14
NetK41_4: K41.4(CB) X?#1.14
NetK42_2: K42.2(-) Q44.3(D)
NetK42_3: K42.3(CA) X?#3.15
NetK42_4: K42.4(CB) X?#1.15
NetK43_2: K43.2(-) Q45.3(D)
NetK43_3: K43.3(CA) X?#3.16
NetK43_4: K43.4(CB) X?#1.16
NetK44_2: K44.2(-) Q27.3(D)
NetK44_3: K44.3(CA) X?#3.17
NetK44_4: K44.4(CB) X?#1.17
NetK45_2: K45.2(-) Q46.3(D)
NetK45_3: K45.3(CA) X?#3.18
NetK45_4: K45.4(CB) X?#1.18
NetK46_2: K46.2(-) Q47.3(D)
NetK46_3: K46.3(CA) X?#3.19
NetK46_4: K46.4(CB) X?#1.19
NetK47_2: K47.2(-) Q48.3(D)
NetK47_3: K47.3(CA) X?#3.20
NetK47_4: K47.4(CB) X?#1.20
NetK48_2: K48.2(-) Q49.3(D)
NetK48_3: K48.3(CA) X?#3.21
NetK48_4: K48.4(CB) X?#1.21
NetK49_2: K49.2(-) Q50.3(D)
NetK49_3: K49.3(CA) X?#3.22
NetK49_4: K49.4(CB) X?#1.22
NetK50_2: K50.2(-) Q51.3(D)
NetK50_3: K50.3(CA) X?#3.23
NetK50_4: K50.4(CB) X?#1.23
NetK51_2: K51.2(-) Q52.3(D)
NetK51_3: K51.3(CA) X?#3.24
NetK51_4: K51.4(CB) X?#1.24
NetK52_2: K52.2(-) Q53.3(D)
NetK52_3: K52.3(CA) X?#3.25
NetK52_4: K52.4(CB) X?#1.25
NetK53_2: K53.2(-) Q54.3(D)
NetK53_3: K53.3(CA) X?#3.26
NetK53_4: K53.4(CB) X?#1.26
NetK54_2: K54.2(-) Q55.3(D)
NetK54_3: K54.3(CA) X?#3.27
NetK54_4: K54.4(CB) X?#1.27
NetK55_2: K55.2(-) Q56.3(D)
NetK55_3: K55.3(CA) X?#3.28
NetK55_4: K55.4(CB) X?#1.28
NetK56_2: K56.2(-) Q57.3(D)
NetK56_3: K56.3(CA) X?#3.29
NetK56_4: K56.4(CB) X?#1.29
NetK57_2: K57.2(-) Q58.3(D)
NetK57_3: K57.3(CA) X?#3.30
NetK57_4: K57.4(CB) X?#1.30
NetK58_2: K58.2(-) Q59.3(D)
NetK58_3: K58.3(CA) X?#3.31
NetK58_4: K58.4(CB) X?#1.31
NetK59_2: K59.2(-) Q60.3(D)
NetK59_3: K59.3(CA) X?#3.32
NetK59_4: K59.4(CB) X?#1.32
NetK60_2: K60.2(-) Q61.3(D)
NetK60_3: K60.3(CA) X?#3.33
NetK60_4: K60.4(CB) X?#1.33
NetK61_2: K61.2(-) Q62.3(D)
NetK61_3: K61.3(CA) X?#3.34
NetK61_4: K61.4(CB) X?#1.34
NetK62_2: K62.2(-) Q63.3(D)
NetK62_3: K62.3(CA) X?#3.35
NetK62_4: K62.4(CB) X?#1.35
NetK63_2: K63.2(-) Q64.3(D)
NetK63_3: K63.3(CA) X?#3.36
NetK63_4: K63.4(CB) X?#1.36
NetK64_2: K64.2(-) Q65.3(D)
NetK64_3: K64.3(CA) X?#3.37
NetK64_4: K64.4(CB) X?#1.37
NetK65_2: K65.2(-) Q66.3(D)
NetK65_3: K65.3(CA) X?#3.38
NetK65_4: K65.4(CB) X?#1.38
NetK66_2: K66.2(-) Q67.3(D)
NetK66_3: K66.3(CA) X?#3.39
NetK66_4: K66.4(CB) X?#1.39
NetK67_2: K67.2(-) Q68.3(D)
NetK67_3: K67.3(CA) X?#3.40
NetK67_4: K67.4(CB) X?#1.40
NetK68_2: K68.2(-) Q69.3(D)
NetK68_3: K68.3(CA) X?#3.41
NetK68_4: K68.4(CB) X?#1.41
NetK69_2: K69.2(-) Q70.3(D)
NetK69_3: K69.3(CA) X?#3.42
NetK69_4: K69.4(CB) X?#1.42
NetK70_2: K70.2(-) Q71.3(D)
NetK70_3: K70.3(CA) X?#3.43
NetK70_4: K70.4(CB) X?#1.43
NetK71_2: K71.2(-) Q72.3(D)
NetK71_3: K71.3(CA) X?#3.44
NetK71_4: K71.4(CB) X?#1.44
NetK72_2: K72.2(-) Q73.3(D)
NetK72_3: K72.3(CA) X?#3.45
NetK72_4: K72.4(CB) X?#1.45
NetK73_2: K73.2(-) Q74.3(D)
NetK73_3: K73.3(CA) X?#3.46
NetK73_4: K73.4(CB) X?#1.46
NetK74_2: K74.2(-) Q75.3(D)
NetK74_3: K74.3(CA) X?#3.47
NetK74_4: K74.4(CB) X?#1.47
NetK75_2: K75.2(-) Q76.3(D)
NetK75_3: K75.3(CA) X?#3.48
NetK75_4: K75.4(CB) X?#1.48
NetK76_2: K76.2(-) Q?#1.3(D)
NetK76_3: K76.3(CA) X?#3.49
NetK76_4: K76.4(CB) X?#1.49
NetK77_2: K77.2(-) Q?#2.3(D)
NetK77_3: K77.3(CA) X?#3.50
NetK77_4: K77.4(CB) X?#1.50
NetK78_2: K78.2(-) Q?#3.3(D)
NetK78_3: K78.3(CA) X?#3.51
NetK78_4: K78.4(CB) X?#1.51
NetK79_2: K79.2(-) Q?#4.3(D)
NetK79_3: K79.3(CA) X?#3.52
NetK79_4: K79.4(CB) X?#1.52
NetK80_2: K80.2(-) Q?#5.3(D)
NetK80_3: K80.3(CA) X?#3.53
NetK80_4: K80.4(CB) X?#1.53
NetK81_2: K81.2(-) Q?#6.3(D)
NetK81_3: K81.3(CA) X?#3.54
NetK81_4: K81.4(CB) X?#1.54
NetK82_2: K82.2(-) Q?#7.3(D)
NetK82_3: K82.3(CA) X?#3.55
NetK82_4: K82.4(CB) X?#1.55
NetK83_2: K83.2(-) Q?#8.3(D)
NetK83_3: K83.3(CA) X?#3.56
NetK83_4: K83.4(CB) X?#1.56
NetK84_2: K84.2(-) Q?#9.3(D)
NetK84_3: K84.3(CA) X?#3.57
NetK84_4: K84.4(CB) X?#1.57
NetK85_2: K85.2(-) Q?#10.3(D)
NetK85_3: K85.3(CA) X?#3.58
NetK85_4: K85.4(CB) X?#1.58
NetK86_2: K86.2(-) Q?#11.3(D)
NetK86_3: K86.3(CA) X?#3.59
NetK86_4: K86.4(CB) X?#1.59
NetK87_2: K87.2(-) Q?#12.3(D)
NetK87_3: K87.3(CA) X?#3.60
NetK87_4: K87.4(CB) X?#1.60
NetK88_2: K88.2(-) Q?#13.3(D)
NetK88_3: K88.3(CA) X?#3.61
NetK88_4: K88.4(CB) X?#1.61
NetK89_2: K89.2(-) Q?#14.3(D)
NetK89_3: K89.3(CA) X?#3.62
NetK89_4: K89.4(CB) X?#1.62
NetK90_2: K90.2(-) Q?#15.3(D)
NetK90_3: K90.3(CA) X?#3.63
NetK90_4: K90.4(CB) X?#1.63
NetK91_2: K91.2(-) Q?#16.3(D)
NetK91_3: K91.3(CA) X?#3.64
NetK91_4: K91.4(CB) X?#1.64

### Buses and harness runs
bus ABUS[7..0] = port ABUS[7..0]
bus DRV[103..1] = port DRV[103..1]

### Notes on the sheet
- designed by
- reviewed by
- last drawn by
- Schematic:
- Project:
- last printed
- DIN-A3 P
- sheets
- of
- File:

### Library data of the parts
K28-K91 = 118-1-A-5/2D: 5V Signal Relais, Normal Open; 04. Manufacturer: Pickering; 03. Unit Price: 2.60; 05. Quantity: 1000; 06. Data Sheet: Pickering_series_118.pdf; 13. Created Date/Name: 20.12.17 S. Kaiser; Coil Resistance: 1500 Ohm; Max Carry Current: 1.2 A; Max Switch Current: 1A; Max Switch Voltage: 200V; Power Rating: 15W; 01. Distributor: Pickering; 02. Distributor Part Number: 118-1-A-5/2D; 07. Manufacturer  Part Number: 118-1-A-5/2D; 09. Operating Temperature: -20°C ~ +85°C; 11. RoHS: 2011/65/EU; ComponentLink1Description: Info; ComponentLink1URL: http://www.pickeringrelay.com/; ComponentLink2Description: DataSheet; ComponentLink2URL: https://www.pickeringrelay.com/products/single-line-sil-series-111-119/single-line-sil-series-118/; Coil Voltage: 5V
Q27 Q28 Q31-Q76 Q?#1-Q?#16 = FDV303N: as Q11 on sheet PowerRouting; 01. Distributor: DigiKey; 02. Distributor Part Number: FDV303NDKR-ND; 07. Manufacturer  Part Number: FDV303N; 09. Operating Temperature: -55°C ~ 150°C (TJ); 11. RoHS: YES; ComponentLink1Description: Info; ComponentLink1URL: https://www.digikey.de/product-detail/en/on-semiconductor/FDV303N/FDV303NDKR-ND/1630434; ComponentLink2Description: DataSheet; ComponentLink2URL: https://media.digikey.com/pdf/Data%20Sheets/Fairchild%20PDFs/FDV303N.pdf; Vdss: 25V; Id: 680mA
R32 R33 R48-R93 R?#1-R?#16 = R: as R16 on sheet PowerRouting; ComponentLink1URL: *; ComponentLink1Description: Info; 09. Operating Temperature: -xx..+yy°C; 11. RoHS: ???; ComponentLink2Description: DataSheet; Package: *
X?#1 = TFC-132-01-F-D-LA: CONN HEADER TH RA 48POS 1.27MM; 04. Manufacturer: Samtec Inc.; 03. Unit Price: 5; 13. Created Date/Name: ??? / Hören; System: Connector; 01. Distributor: Samtec Inc.; 02. Distributor Part Number: TFC-132-01-F-D-LA; 07. Manufacturer  Part Number: TFC-132-01-F-D-LA; 11. RoHS: YES; ComponentLink1Description: Info; ComponentLink1URL: https://www.samtec.com/products/tfc-124-01-f-d-ra; ComponentLink2Description: DataSheet
X?#2 = SFSD-32-30C-G-15.00-S: 32 x 2 x 1.27mm SOCKET DISCRETE CABL COLORED; 04. Manufacturer: Samtec Inc.; 03. Unit Price: 10; 13. Created Date/Name: ??? / Hören; 01. Distributor: Samtec Inc.; 02. Distributor Part Number: SFSD-32-30C-G-15.00-S; 07. Manufacturer  Part Number: SFSD-32-30C-G-15.00-S; 11. RoHS: YES; ComponentLink1Description: Info; ComponentLink1URL: https://www.samtec.com/products/sfsd-24-30c-g-15.00-s; ComponentLink2Description: DataSheet
X?#3 = CONFIG64: PCB Tester Configuration Matrix for 48 Relays over 8 ABUSes; 13. Created Date/Name: ??? / Hören; ComponentLink1Description: Info; ComponentLink2Description: DataSheet

## Nets that join several sheets
1V8: ADC (U2.2), RelayDriver (C9.1 L1.1)
3V3: Controller (5 pins), ADC (C2.1 U2.9 U2.10), X7A15T-Prog (10 pins), X7A15T-Fabric (6 pins), Controller/Input (D2_Controller_Input#1.2), Controller/Input (D2_Controller_Input#2.2), Controller/Input (D2_Controller_Input#3.2), Controller/Input (D2_Controller_Input#4.2), Controller/Input (D2_Controller_Input#5.2)
5V0: PSU2 (R99.2 R101.2 R103.2 R105.2), Controller (X1.2 X1.4), ADC (C4.1 D1.2 U1.5), Controller/Output (Q29_Controller_Output#1.2 R36_Controller_Output#1.2), Controller/Output (Q29_Controller_Output#2.2 R36_Controller_Output#2.2), Controller/Output (Q29_Controller_Output#3.2 R36_Controller_Output#3.2), Controller/Output (Q29_Controller_Output#4.2 R36_Controller_Output#4.2), Controller/Output (Q29_Controller_Output#5.2 R36_Controller_Output#5.2)
5V0R: Instrument1 (K1_Instrument1.1), Instrument2 (K1_Instrument2.1), Instrument3 (K1_Instrument3.1), Instrument4 (K1_Instrument4.1), Instrument5 (K1_Instrument5.1), Instrument6 (K1_Instrument6.1), Instrument7 (K1_Instrument7.1), Instrument8 (K1_Instrument8.1), ADC (10 pins), PowerRouting (16 pins), SignalRouting (64 pins)
24V0: Controller/Input (X31_Controller_Input#1.1), Controller/Output (D3_Controller_Output#1.3 X33_Controller_Output#1.1), Controller/Output (D3_Controller_Output#2.3 X33_Controller_Output#2.1), Controller/Output (D3_Controller_Output#3.3 X33_Controller_Output#3.1), Controller/Output (D3_Controller_Output#4.3 X33_Controller_Output#4.1), Controller/Output (D3_Controller_Output#5.3 X33_Controller_Output#5.1), Controller/Input (X31_Controller_Input#2.1), Controller/Input (X31_Controller_Input#3.1), Controller/Input (X31_Controller_Input#4.1), Controller/Input (X31_Controller_Input#5.1)
GND: PSU2 (70 pins), X7A15T-Decoupling (53 pins), Instrument1 (BNC1_Instrument1.0 Q77_Instrument1.2 R1_Instrument1.1), Instrument2 (BNC1_Instrument2.0 Q77_Instrument2.2 R1_Instrument2.1), Instrument3 (BNC1_Instrument3.0 Q77_Instrument3.2 R1_Instrument3.1), Instrument4 (BNC1_Instrument4.0 Q77_Instrument4.2 R1_Instrument4.1), Instrument5 (BNC1_Instrument5.0 Q77_Instrument5.2 R1_Instrument5.1), Instrument6 (BNC1_Instrument6.0 Q77_Instrument6.2 R1_Instrument6.1), Instrument7 (BNC1_Instrument7.0 Q77_Instrument7.2 R1_Instrument7.1), Instrument8 (BNC1_Instrument8.0 Q77_Instrument8.2 R1_Instrument8.1), Controller (14 pins), ADC (33 pins), RelayDriver (C9.2 C10.2), X7A15T-Prog (16 pins), X7A15T-Fabric (C17.2 J3.3 U8.4 Y1.2), Controller/Input (D2_Controller_Input#1.1 R35_Controller_Input#1.1), Controller/Output (Q30_Controller_Output#1.2 R38_Controller_Output#1.1 U6_Controller_Output#1.2 U6_Controller_Output#1.3), Controller/Output (Q30_Controller_Output#2.2 R38_Controller_Output#2.1 U6_Controller_Output#2.2 U6_Controller_Output#2.3), Controller/Output (Q30_Controller_Output#3.2 R38_Controller_Output#3.1 U6_Controller_Output#3.2 U6_Controller_Output#3.3), Controller/Output (Q30_Controller_Output#4.2 R38_Controller_Output#4.1 U6_Controller_Output#4.2 U6_Controller_Output#4.3), Controller/Output (Q30_Controller_Output#5.2 R38_Controller_Output#5.1 U6_Controller_Output#5.2 U6_Controller_Output#5.3), Controller/Input (D2_Controller_Input#2.1 R35_Controller_Input#2.1), Controller/Input (D2_Controller_Input#3.1 R35_Controller_Input#3.1), Controller/Input (D2_Controller_Input#4.1 R35_Controller_Input#4.1), Controller/Input (D2_Controller_Input#5.1 R35_Controller_Input#5.1), PowerRouting (32 pins), SignalRouting (128 pins)
~{CS0}: Controller (X1.24), ADC (U2.6)
~{CS1}: Controller (X1.26), X7A15T-Fabric (U7.A9)
ABUS0: Instrument1 (K1_Instrument1.4), ADC (K2.3), SignalRouting (X?#3.ABUS0)
ABUS1: Instrument2 (K1_Instrument2.4), ADC (K3.3), SignalRouting (X?#3.ABUS1)
ABUS2: Instrument3 (K1_Instrument3.4), ADC (K4.3), SignalRouting (X?#3.ABUS2)
ABUS3: Instrument4 (K1_Instrument4.4), ADC (K5.3), SignalRouting (X?#3.ABUS3)
ABUS4: Instrument5 (K1_Instrument5.4), ADC (K6.3), SignalRouting (X?#3.ABUS4)
ABUS5: Instrument6 (K1_Instrument6.4), ADC (K7.3), SignalRouting (X?#3.ABUS5)
ABUS6: Instrument7 (K1_Instrument7.4), ADC (K8.3), SignalRouting (X?#3.ABUS6)
ABUS7: Instrument8 (K1_Instrument8.4), ADC (K9.3), SignalRouting (X?#3.ABUS7)
DRV1: Instrument2 (Q77_Instrument2.1 R1_Instrument2.2), SignalRouting (8 pins)
DRV16: Instrument1 (Q77_Instrument1.1 R1_Instrument1.2), SignalRouting (8 pins)
DRV18: Instrument3 (Q77_Instrument3.1 R1_Instrument3.2), SignalRouting (8 pins)
DRV19: Instrument4 (Q77_Instrument4.1 R1_Instrument4.2), SignalRouting (8 pins)
DRV100: Instrument5 (Q77_Instrument5.1 R1_Instrument5.2), SignalRouting (8 pins)
DRV101: Instrument6 (Q77_Instrument6.1 R1_Instrument6.2), SignalRouting (8 pins)
DRV102: Instrument7 (Q77_Instrument7.1 R1_Instrument7.2), SignalRouting (8 pins)
DRV103: Instrument8 (Q77_Instrument8.1 R1_Instrument8.2), SignalRouting (8 pins)
In1: Controller (X1.11), Controller/Input (D2_Controller_Input#1.3 R34_Controller_Input#1.2 R35_Controller_Input#1.2)
In2: Controller (X1.13), Controller/Input (D2_Controller_Input#2.3 R34_Controller_Input#2.2 R35_Controller_Input#2.2)
In3: Controller (X1.15), Controller/Input (D2_Controller_Input#3.3 R34_Controller_Input#3.2 R35_Controller_Input#3.2)
In4: Controller (X1.35), Controller/Input (D2_Controller_Input#4.3 R34_Controller_Input#4.2 R35_Controller_Input#4.2)
In5: Controller (X1.37), Controller/Input (D2_Controller_Input#5.3 R34_Controller_Input#5.2 R35_Controller_Input#5.2)
MISO: Controller (X1.21), ADC (U2.7), X7A15T-Fabric (U7.C11)
MOSI: Controller (X1.19), X7A15T-Fabric (U7.C10)
SCLK: Controller (X1.23), ADC (U2.8), X7A15T-Fabric (U7.A10)